# Altium schematic sheet ADC_0_MUL.SchDoc
size 420 x 297 mm; SheetNumber: 3; SheetTotal: 13
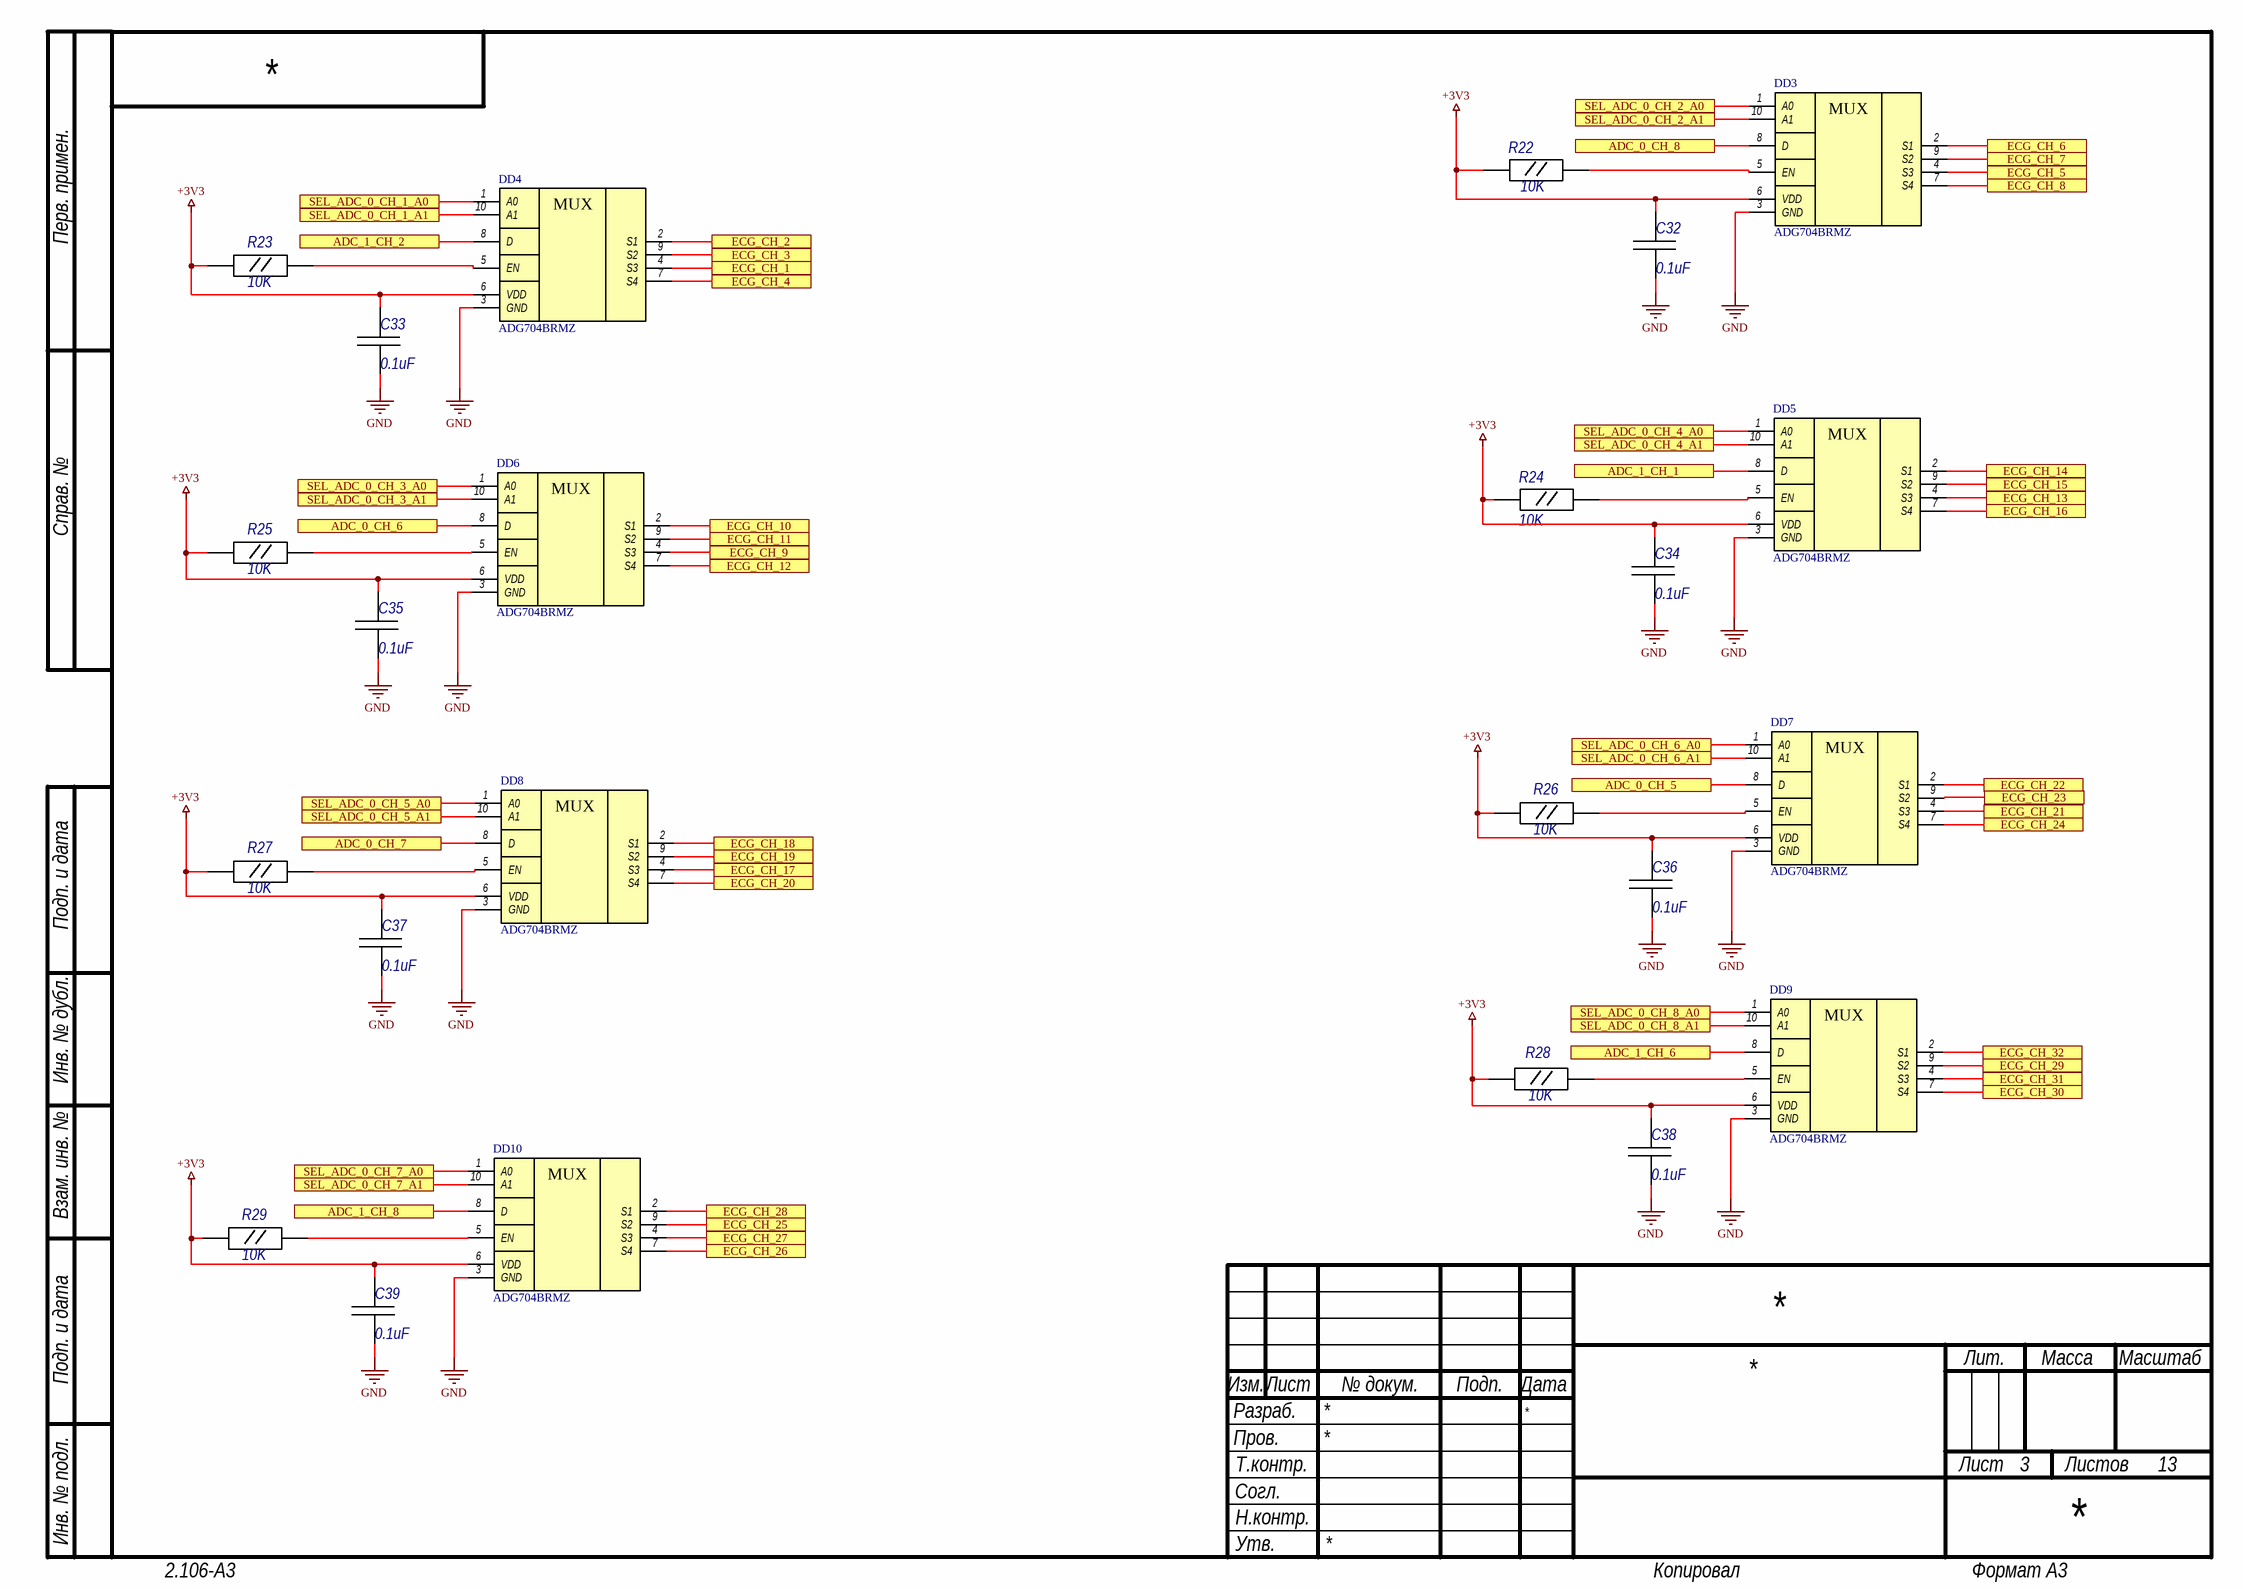
[diagram p0: ADC_0_MUL.SchDoc]

## Parts
C32  0.1uF  [C0603]
C33  0.1uF  [C0603]
C34  0.1uF  [C0603]
C35  0.1uF  [C0603]
C36  0.1uF  [C0603]
C37  0.1uF  [C0603]
C38  0.1uF  [C0603]
C39  0.1uF  [C0603]
DD3  ADG704BRMZ  [MSOP-10]
DD4  ADG704BRMZ  [MSOP-10]
DD5  ADG704BRMZ  [MSOP-10]
DD6  ADG704BRMZ  [MSOP-10]
DD7  ADG704BRMZ  [MSOP-10]
DD8  ADG704BRMZ  [MSOP-10]
DD9  ADG704BRMZ  [MSOP-10]
DD10  ADG704BRMZ  [MSOP-10]
R22  10K  [R0603]
R23  10K  [R0603]
R24  10K  [R0603]
R25  10K  [R0603]
R26  10K  [R0603]
R27  10K  [R0603]
R28  10K  [R0603]
R29  10K  [R0603]

## Ports
ADC_0_CH_5, ADC_0_CH_6, ADC_0_CH_7, ADC_0_CH_8, ADC_1_CH_1, ADC_1_CH_2, ADC_1_CH_6, ADC_1_CH_8, ECG_CH_1, ECG_CH_2, ECG_CH_3, ECG_CH_4, ECG_CH_5, ECG_CH_6, ECG_CH_7, ECG_CH_8, ECG_CH_9, ECG_CH_10, ECG_CH_11, ECG_CH_12, ECG_CH_13, ECG_CH_14, ECG_CH_15, ECG_CH_16, ECG_CH_17, ECG_CH_18, ECG_CH_19, ECG_CH_20, ECG_CH_21, ECG_CH_22, ECG_CH_23, ECG_CH_24, ECG_CH_25, ECG_CH_26, ECG_CH_27, ECG_CH_28, ECG_CH_29, ECG_CH_30, ECG_CH_31, ECG_CH_32, SEL_ADC_0_CH_1_A0, SEL_ADC_0_CH_1_A1, SEL_ADC_0_CH_2_A0, SEL_ADC_0_CH_2_A1, SEL_ADC_0_CH_3_A0, SEL_ADC_0_CH_3_A1, SEL_ADC_0_CH_4_A0, SEL_ADC_0_CH_4_A1, SEL_ADC_0_CH_5_A0, SEL_ADC_0_CH_5_A1, SEL_ADC_0_CH_6_A0, SEL_ADC_0_CH_6_A1, SEL_ADC_0_CH_7_A0, SEL_ADC_0_CH_7_A1, SEL_ADC_0_CH_8_A0, SEL_ADC_0_CH_8_A1

## Nets
+3V3: C32.2 C33.2 C34.2 C35.2 C36.2 C37.2 C38.2 C39.2 DD3.6(VDD) DD4.6(VDD) DD5.6(VDD) DD6.6(VDD) DD7.6(VDD) DD8.6(VDD) DD9.6(VDD) DD10.6(VDD) R22.1 R23.1 R24.1 R25.1 R26.1 R27.1 R28.1 R29.1
GND: C32.1 C33.1 C34.1 C35.1 C36.1 C37.1 C38.1 C39.1 DD3.3(GND) DD4.3(GND) DD5.3(GND) DD6.3(GND) DD7.3(GND) DD8.3(GND) DD9.3(GND) DD10.3(GND)
ADC_0_CH_5: DD7.8(D) ; port ADC_0_CH_5
ADC_0_CH_6: DD6.8(D) ; port ADC_0_CH_6
ADC_0_CH_7: DD8.8(D) ; port ADC_0_CH_7
ADC_0_CH_8: DD3.8(D) ; port ADC_0_CH_8
ADC_1_CH_1: DD5.8(D) ; port ADC_1_CH_1
ADC_1_CH_2: DD4.8(D) ; port ADC_1_CH_2
ADC_1_CH_6: DD9.8(D) ; port ADC_1_CH_6
ADC_1_CH_8: DD10.8(D) ; port ADC_1_CH_8
ECG_CH_1: DD4.4(S3) ; port ECG_CH_1
ECG_CH_2: DD4.2(S1) ; port ECG_CH_2
ECG_CH_3: DD4.9(S2) ; port ECG_CH_3
ECG_CH_4: DD4.7(S4) ; port ECG_CH_4
ECG_CH_5: DD3.4(S3) ; port ECG_CH_5
ECG_CH_6: DD3.2(S1) ; port ECG_CH_6
ECG_CH_7: DD3.9(S2) ; port ECG_CH_7
ECG_CH_8: DD3.7(S4) ; port ECG_CH_8
ECG_CH_9: DD6.4(S3) ; port ECG_CH_9
ECG_CH_10: DD6.2(S1) ; port ECG_CH_10
ECG_CH_11: DD6.9(S2) ; port ECG_CH_11
ECG_CH_12: DD6.7(S4) ; port ECG_CH_12
ECG_CH_13: DD5.4(S3) ; port ECG_CH_13
ECG_CH_14: DD5.2(S1) ; port ECG_CH_14
ECG_CH_15: DD5.9(S2) ; port ECG_CH_15
ECG_CH_16: DD5.7(S4) ; port ECG_CH_16
ECG_CH_17: DD8.4(S3) ; port ECG_CH_17
ECG_CH_18: DD8.2(S1) ; port ECG_CH_18
ECG_CH_19: DD8.9(S2) ; port ECG_CH_19
ECG_CH_20: DD8.7(S4) ; port ECG_CH_20
ECG_CH_21: DD7.4(S3) ; port ECG_CH_21
ECG_CH_22: DD7.2(S1) ; port ECG_CH_22
ECG_CH_23: DD7.9(S2) ; port ECG_CH_23
ECG_CH_24: DD7.7(S4) ; port ECG_CH_24
ECG_CH_25: DD10.9(S2) ; port ECG_CH_25
ECG_CH_26: DD10.7(S4) ; port ECG_CH_26
ECG_CH_27: DD10.4(S3) ; port ECG_CH_27
ECG_CH_28: DD10.2(S1) ; port ECG_CH_28
ECG_CH_29: DD9.9(S2) ; port ECG_CH_29
ECG_CH_30: DD9.7(S4) ; port ECG_CH_30
ECG_CH_31: DD9.4(S3) ; port ECG_CH_31
ECG_CH_32: DD9.2(S1) ; port ECG_CH_32
SEL_ADC_0_CH_1_A0: DD4.1(A0) ; port SEL_ADC_0_CH_1_A0
SEL_ADC_0_CH_1_A1: DD4.10(A1) ; port SEL_ADC_0_CH_1_A1
SEL_ADC_0_CH_2_A0: DD3.1(A0) ; port SEL_ADC_0_CH_2_A0
SEL_ADC_0_CH_2_A1: DD3.10(A1) ; port SEL_ADC_0_CH_2_A1
SEL_ADC_0_CH_3_A0: DD6.1(A0) ; port SEL_ADC_0_CH_3_A0
SEL_ADC_0_CH_3_A1: DD6.10(A1) ; port SEL_ADC_0_CH_3_A1
SEL_ADC_0_CH_4_A0: DD5.1(A0) ; port SEL_ADC_0_CH_4_A0
SEL_ADC_0_CH_4_A1: DD5.10(A1) ; port SEL_ADC_0_CH_4_A1
SEL_ADC_0_CH_5_A0: DD8.1(A0) ; port SEL_ADC_0_CH_5_A0
SEL_ADC_0_CH_5_A1: DD8.10(A1) ; port SEL_ADC_0_CH_5_A1
SEL_ADC_0_CH_6_A0: DD7.1(A0) ; port SEL_ADC_0_CH_6_A0
SEL_ADC_0_CH_6_A1: DD7.10(A1) ; port SEL_ADC_0_CH_6_A1
SEL_ADC_0_CH_7_A0: DD10.1(A0) ; port SEL_ADC_0_CH_7_A0
SEL_ADC_0_CH_7_A1: DD10.10(A1) ; port SEL_ADC_0_CH_7_A1
SEL_ADC_0_CH_8_A0: DD9.1(A0) ; port SEL_ADC_0_CH_8_A0
SEL_ADC_0_CH_8_A1: DD9.10(A1) ; port SEL_ADC_0_CH_8_A1
NetDD3_5: DD3.5(EN) R22.2
NetDD4_5: DD4.5(EN) R23.2
NetDD5_5: DD5.5(EN) R24.2
NetDD6_5: DD6.5(EN) R25.2
NetDD7_5: DD7.5(EN) R26.2
NetDD8_5: DD8.5(EN) R27.2
NetDD9_5: DD9.5(EN) R28.2
NetDD10_5: DD10.5(EN) R29.2

## Notes on the sheet
- Перв. примен.
- Справ. №
- Подп. и дата
- Инв. № дубл.
- Взам. инв. №
- Разраб.
- Изм.
- Лист
- № докум.
- Подп.
- Дата
- Лит.
- Масса
- Масштаб
- Пров.
- Т.контр.
- Листов
- Инв. № подл.
- Согл.
- Утв.
- Н.контр.
- 2.106-A3
- Копировал
- Формат А3
- (in symbol MUX_ADG704BRMZ) MUX

## Library data of the parts
C32-C39 = CC_SMD_0603: Ceramic Capacitor SMD; Package: 0603; Value: 0.1uF
DD3-DD10 = MUX_ADG704BRMZ: 4-Channel Multiplexer; PartNumber: ADG704BRMZ; Package: MSOP-10
R22-R29 = R0603: Resistor SMD; Value: 10K